# Altium schematic sheet 13_USB3_0_peripheral.SchDoc: USB3_0 Peripheral
size A3; Author: NeoExiZ; CompanyName: BUPT CPS Lab; Engineer: NeoExiZ; Organization: NeoExiZ; Address1: 418, 4#Building,BUPT; Address2: No.10, Xitucheng Road; Address3: Beijing; Address4: China
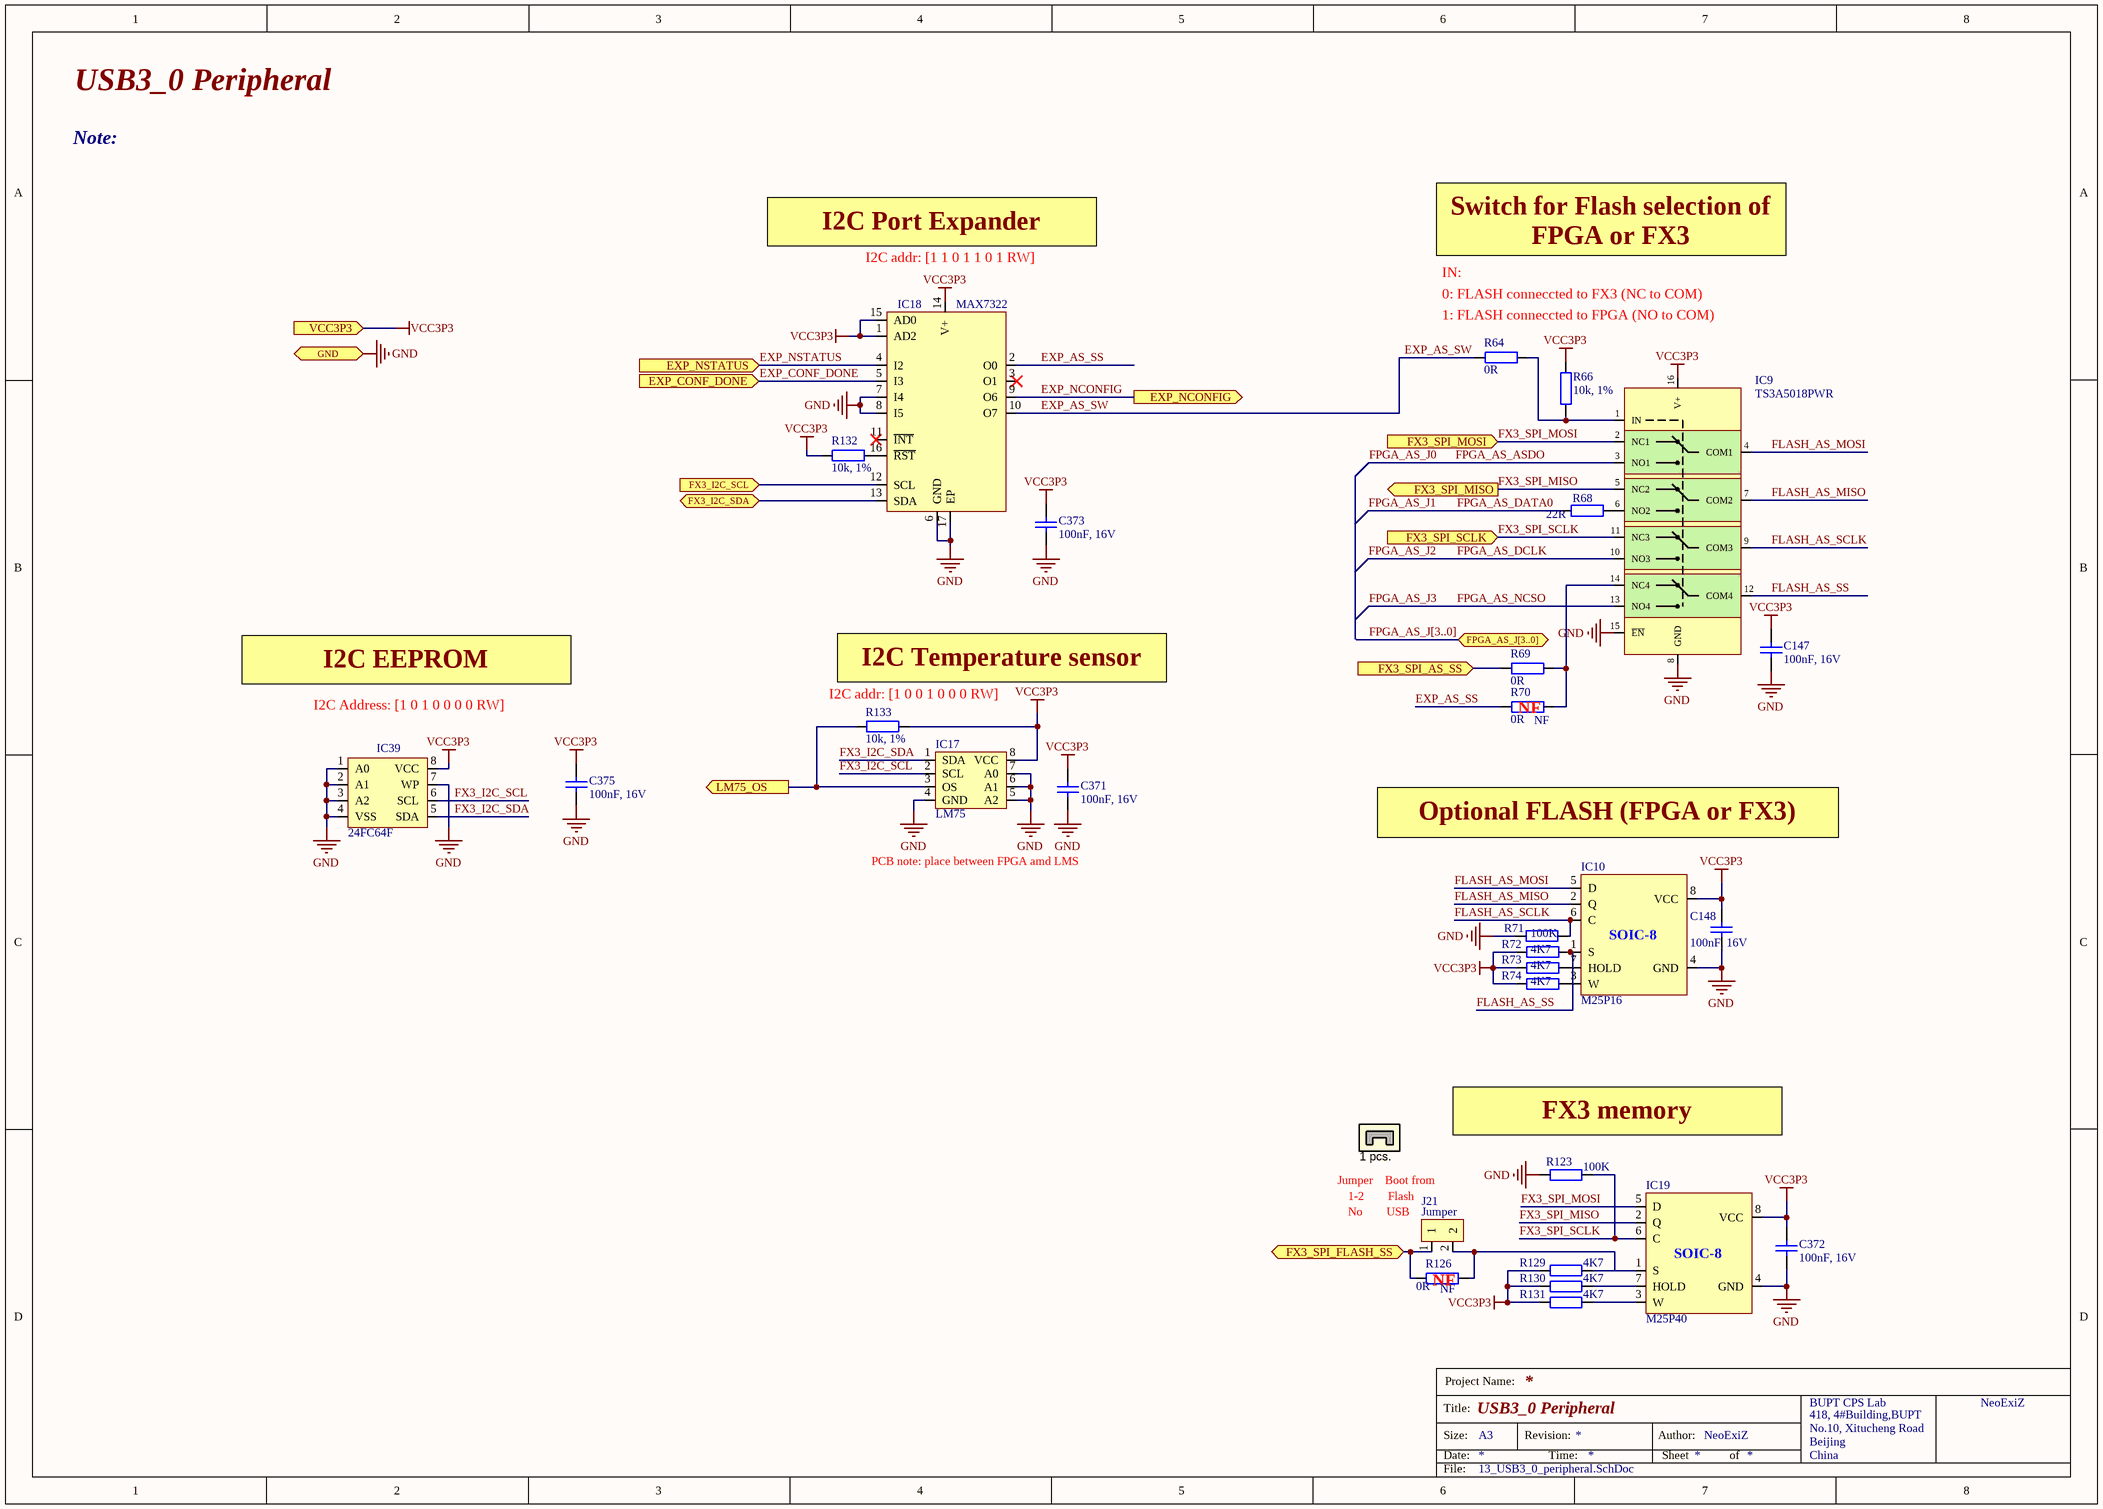
[diagram p0: 13_USB3_0_peripheral.SchDoc]

## Parts
C147  100nF, 16V  [CAP0402]
C148  100nF, 16V  [CAP0402]
C371  100nF, 16V  [CAP0402]
C372  100nF, 16V  [CAP0402]
C373  100nF, 16V  [CAP0402]
C375  100nF, 16V  [CAP0402]
IC9  TS3A5018PWR  [TS3A5018PWR]
IC10  M25P16  [M25P40-VMN6TPB_SO8N]
IC17  LM75  [HWSON8_LM75]
IC18  MAX7322  [MAX7322ATE_QFN16]
IC19  M25P40  [M25P40-VMN6TPB_SO8N]
IC39  24FC64F  [24FC512]
J21  Jumper  [HDR_1x2_HALF_PITCH]
JMP1  1 pcs.  [MECH_JUMPER_HALF_PITCH]
R64  0R  [RES0402]
R66  10k, 1%  [RES0402]
R68  22R  [RES0402]
R69  0R  [RES0402]
R70  0R  Assembly Info: NF  [RES0402]
R71  100K  [RES0402]
R72  4K7  [RES0402]
R73  4K7  [RES0402]
R74  4K7  [RES0402]
R123  100K  [RES0402]
R126  0R  Assembly Info: NF  [RES0402]
R129  4K7  [RES0402]
R130  4K7  [RES0402]
R131  4K7  [RES0402]
R132  10k, 1%  [RES0402]
R133  10k, 1%  [RES0402]

## Ports
EXP_CONF_DONE (in), EXP_NCONFIG (out), EXP_NSTATUS (in), FPGA_AS_J[3..0], FX3_I2C_SCL (in), FX3_I2C_SDA (bidir), FX3_SPI_AS_SS (in), FX3_SPI_FLASH_SS (bidir), FX3_SPI_MISO (out), FX3_SPI_MOSI (in), FX3_SPI_SCLK (in), GND, LM75_OS (out), VCC3P3 (in)

## Nets
GND: C147.2 C148.2 C371.2 C372.2 C373.2 C375.2 IC9.8(GND) IC9.15(~{EN}) IC10.4(GND) IC17.4(GND) IC17.5(A2) IC17.6(A1) IC17.7(A0) IC18.6(GND) IC18.7(I4) IC18.8(I5) IC18.17(EP) IC19.4(GND) IC39.1(A0) IC39.2(A1) IC39.3(A2) IC39.4(VSS) IC39.7(WP) R71.2 R123.1 ; port GND
VCC3P3: C147.1 C148.1 C371.1 C372.1 C373.1 C375.1 IC9.16(V+) IC10.8(VCC) IC17.8(VCC) IC18.1(AD2) IC18.14(V+) IC18.15(AD0) IC19.8(VCC) IC39.8(VCC) R66.1 R72.1 R73.1 R74.1 R129.1 R130.1 R131.1 R132.1 R133.2 ; port VCC3P3
EXP_AS_SS: IC18.2(O0) R70.2
EXP_AS_SW: IC18.10(O7) R64.2
EXP_CONF_DONE: IC18.5(I3) ; port EXP_CONF_DONE
EXP_NCONFIG: IC18.9(O6) ; port EXP_NCONFIG
EXP_NSTATUS: IC18.4(I2) ; port EXP_NSTATUS
FLASH_AS_MISO: IC9.7(COM2) IC10.2(Q)
FLASH_AS_MOSI: IC9.4(COM1) IC10.5(D)
FLASH_AS_SCLK: IC9.9(COM3) IC10.6(C) R71.1
FLASH_AS_SS: IC9.12(COM4) IC10.1(S) R72.2
FPGA_AS_ASDO: IC9.3(NO1)  [also labelled FPGA_AS_J0]
FPGA_AS_DATA0: R68.2  [also labelled FPGA_AS_J1]
FPGA_AS_DCLK: IC9.10(NO3)  [also labelled FPGA_AS_J2]
FPGA_AS_J3: IC9.13(NO4)  [also labelled FPGA_AS_NCSO]
FX3_I2C_SCL: IC17.2(SCL) IC39.6(SCL)
FX3_I2C_SCL: IC18.12(SCL) ; port FX3_I2C_SCL  [a separate net that carries the same name]
FX3_I2C_SDA: IC17.1(SDA) IC39.5(SDA)
FX3_I2C_SDA: IC18.13(SDA) ; port FX3_I2C_SDA  [a separate net that carries the same name]
FX3_SPI_AS_SS: R69.2 ; port FX3_SPI_AS_SS
FX3_SPI_FLASH_SS: J21.1 R126.1 ; port FX3_SPI_FLASH_SS
FX3_SPI_MISO: IC9.5(NC2) IC19.2(Q) ; port FX3_SPI_MISO
FX3_SPI_MOSI: IC9.2(NC1) IC19.5(D) ; port FX3_SPI_MOSI
FX3_SPI_SCLK: IC9.11(NC3) IC19.6(C) R123.2 ; port FX3_SPI_SCLK
LM75_OS: IC17.3(OS) R133.1 ; port LM75_OS
NetIC9_1: IC9.1(IN) R64.1 R66.2
NetIC9_6: IC9.6(NO2) R68.1
NetIC9_14: IC9.14(NC4) R69.1 R70.1
NetIC10_3: IC10.3(W) R74.2
NetIC10_7: IC10.7(HOLD) R73.2
NetIC18_16: IC18.16(~{RST}) R132.2
NetIC19_1: IC19.1(S) J21.2 R126.2 R129.2
NetIC19_3: IC19.3(W) R131.2
NetIC19_7: IC19.7(HOLD) R130.2

Not connected (* = marked no-connect by the designer): IC18 3(O1)* 11(~{INT})*; JMP1 1 2

## Buses and harness runs
bus FPGA_AS_J[3..0] = port FPGA_AS_J[3..0]

## Notes on the sheet
- I2C Port Expander
- (near IC18) I2C addr: [1 1 0 1 1 0 1 RW]
- Switch for Flash selection of FPGA or FX3
- 0: FLASH conneccted to FX3 (NC to COM)
- IN:
- 1: FLASH conneccted to FPGA (NO to COM)
- I2C EEPROM
- I2C Address: [1 0 1 0 0 0 0 RW]
- (near R133) I2C addr: [1 0 0 1 0 0 0 RW]
- (near R133) I2C Temperature sensor
- (near R70) NF
- Optional FLASH (FPGA or FX3)
- PCB note: place between FPGA amd LMS
- Jumper    Boot from
- FX3 memory
- (near J21) 1-2        Flash
- (near J21) No        USB
- (near R126) NF
- Note:
- Project Name:
- Size:
- Date:
- Title:
- A3
- Revision:
- Time:
- Author:
- Sheet
- of
- File:
- (in symbol M25P40) SOIC-8

## Library data of the parts
C147 C148 C371-C373 C375 = Cap_0603: Manufacturer Part Number 1: GRM155R71C104KA88D; Part Description: 0.10µF ±10% 16V X7R Ceramic Capacitor -55°C ~ 125°C Surface Mount, MLCC 0402 (1005 Metric) 0.039" L x 0.020" W (1.00mm x 0.50mm); Brand: Murata Electronics; Tolerance: 10 %; Type: General Purpose MLCC; Capacitance: 0.1 uF; Temperature Coefficient / Code: +/- 15 %; Supplier 1: Mouser; Supplier Part Number 1: 81-GRM155R71C104KA88; Case Code - in: 0402; Manufacturer: Murata Electronics; Category: Multilayer Ceramic Capacitors MLCC - SMD/SMT; Voltage Rating DC: 16 V; Value: 100nF, 16V; Manufacturer Part Number: GRM155R71C104KA88D
IC9 = TS3A5018PWR: Manufacturer: TEXAS INSTRUMENTS; Part Description: IC SWITCH QUAD SPDT 16TSSOP; On State Resistance Max: 10; Analog Switch Case: TSSOP; Supply Voltage Range: 2.3V to 3.6; No. of Pins: 16; Analog Switch Type: SPDT; Supplier 1: Newark; Manufacturer Part Number 1: TS3A5018PW; Supplier Part Number 1: 71J8329
IC10 = M25P40: Manufacturer Part Number 1: M25P16-VMN6P; Manufacturer: Micron Technology Inc.; Part Description: IC FLASH 16MBIT 75MHZ 8SO; Supply Voltage Min: 2.7; Supply Voltage Max: 3.6; Memory Case Style: NSOIC; Memory Type: Flash; Memory Size: 16; Flash Memory Configuration: 2M x 8; No. of Pins: 8; Clock Frequency: 75; IC Interface Type: Serial, SPI; Page / Burst Read Access: 0.8; Supply Voltage Range: 2.7V to 3.6; Supplier 1: Farnell; Supplier Part Number 1: 1734973; RoHS: YES; Access Time: -; Operating Temperature Min: -40; Operating Temperature Max: 85; Packaging: Each; MSL: MSL 3 - 168 hours; Memory Voltage Vcc: 3.6; Operating Temperature Range: -40°C to +85
IC17 = LM75: Manufacturer: NXP Semiconductors; Manufacturer Part Number: LM75BTP,147; Part Description: SENSOR TEMPERATURE I2C 8HWSON; Sensing Temperature - Local: -55°C ~ 125°C; Output Type: I²C; Accuracy - Highest (Lowest): ±2°C (±3°C); Voltage - Supply: 2.8 V ~ 5.5 V; Test Condition: -25°C ~ 100°C (-55°C ~ 125°C); Sensor Type: Digital, Local; Resolution: 10 b; Supplier 1: Digi-Key; Operating Temperature: -55°C ~ 125°C; Features: Output Switch, Programmable Limit, Shutdown Mode; Supplier Device Package: 8-HWSON (2x3); Sensing Temperature - Remote: -; Category: Sensors, Transducers; Packaging: Tape & Reel (TR); RoHS: RoHS Compliant; Package / Case: 8-WFDFN Exposed Pad; Supplier Part Number 1: 568-9815-2-ND
IC18 = MAX7322ATE+: Manufacturer: Maxim Integrated; Part Description: IC I/O EXPANDER I2C 4B 16TQFN; Interface: I²C; Number of I/O: 4 (Input Only); Voltage - Supply: 1.7 V ~ 5.5 V; Interrupt Output: Yes; Current - Output Source/Sink: 20mA; Frequency - Clock: 400kHz; Supplier 1: Digi-Key; Mounting Type: Surface Mount; Category: Integrated Circuits (ICs); RoHS: RoHS Compliant; Packaging: Tube; Manufacturer Part Number: MAX7322ATE+; Supplier Device Package: 16-TQFN-EP (3x3); Package / Case: 16-WFQFN Exposed Pad; Operating Temperature: -40°C ~ 125°C; Features: POR; Output Type: -; Supplier Part Number 1: MAX7322ATE+-ND
IC19 = M25P40: Manufacturer: Micron Technology Inc; Part Description: IC FLASH 4MBIT 75MHZ 8SO; Manufacturer Part Number 1: M25P40-VMN6TPB; Memory Size: 4M (512K x 8); Voltage - Supply: 2.3 V ~ 3.6 V; Supplier 1: Digi-Key; Supplier Device Package: 8-SO; Supplier Part Number 1: M25P40-VMN6TPBTR-ND
IC39 = 24FC64F: Manufacturer Part Number 1: 24FC64F-I/ST; Manufacturer: Microchip Technology; Part Description: IC EEPROM 512KBIT 1MHZ 8TSSOP; Format - Memory: EEPROMs - Serial; Speed: 400kHz, 1MHz; Interface: I²C, 2-Wire Serial; Memory Type: EEPROM; Memory Size: 64K (8K x 8); Voltage - Supply: 1.7 V ~ 5.5 V; Supplier 1: Digi-Key; Packaging: Tube; Supplier Device Package: 8-TSSOP; Operating Temperature: -40°C ~ 85°C; RoHS: RoHS Compliant; Category: Integrated Circuits (ICs); Package / Case: 8-TSSOP (0.173", 4.40mm Width); Supplier Part Number 1: 24FC64F-I/ST-ND
J21 = Jumper: Manufacturer Part Number 1: GRPB021VWVN-RC; Manufacturer: Sullins Connector Solutions; Part Description: 2 Positions Header, Unshrouded Connector 0.050" (1.27mm) Through Hole Gold; Connector Type: Header, Unshrouded; Number of Positions: 2; Number of Positions Loaded: All; Pitch: 0.050" (1.27mm); Supplier 1: Digi-Key; Supplier Part Number 1: S9014E-02-ND; Contact Mating Length: 0.118" (3.00mm); Mounting Type: Through Hole; Termination: Solder; Fastening Type: -; Features: -; Contact Finish: Gold; Contact Finish Thickness: Flash; Color: -; Category: Connectors, Interconnects; RoHS: RoHS Compliant; Packaging: Bulk; Contact Type: Male Pin; Number of Rows: 1; Row Spacing: -
JMP1 = JUMP_2P_CONN_HEADER: Shorting Jumper, 2-position, 1.27mm pitch; Manufacturer Part Number 1: M50-2030005; Manufacturer: Harwin Inc.; Part Description: CONN SHUNT 1.27MM BLUE W/HANDLE; Gender: Female Sockets; Number of Positions or Pins (Grid): 2 (1 x 2); Pitch: 0.050" (1.27mm); Supplier 1: Digi-Key; Supplier Part Number 1: 952-1732-ND; Category: Connectors, Interconnects; RoHS: RoHS Compliant; Packaging: Bulk; Type: Closed Top, Grip; Height: 0.217" (5.50mm); Contact Finish: Gold; Contact Finish Thickness: 1µin (0.025µm); Color: Blue
R64 R69 R70 = Res_0402: Manufacturer: Yageo; Part Description: RES SMD 0.0OHM JUMPER 1/16W 0402; Supplier 1: Digi-Key; Supplier Part Number 1: 311-0.0JRTR-ND; Composition: Thick Film; Package / Case: 0402 (1005 Metric); Category: Resistors; Value: 0R
R66 R132 R133 = Res_0402: Manufacturer: Yageo; Manufacturer Part Number 1: RC0402FR-0710KL; Part Description: RES SMD 10K OHM 1% 1/16W 0402; Temperature Coefficient: ±100ppm/°C; Power (Watts): 0.063W, 1/16W; Value: 10k, 1%; Supplier 1: Digi-Key; Supplier Part Number 1: 311-10.0KLRTR-ND; Resistance (Ohms): 10k; Packaging: Tape & Reel (TR); RoHS: RoHS Compliant; Package / Case: 0402 (1005 Metric); Tolerance: ±1%; Operating Temperature: -55°C ~ 155°C; Size / Dimension: 0.039" L x 0.020" W (1.00mm x 0.50mm); Number of Terminations: 2; Category: Resistors; Height: 0.016" (0.40mm); Supplier Device Package: 0402; Features: Moisture Resistant; Composition: Thick Film
R68 = Res_0402: Part Description: RES SMD 22 OHM 1% 1/16W 0402; Manufacturer Part Number 1: RC0402FR-0722RL; Manufacturer: Yageo; Tolerance: ±1%; Temperature Coefficient: ±100ppm/°C; Resistance (Ohms): 22; Supplier 1: Digi-Key; Supplier Part Number 1: 311-22.0LRTR-ND; Supplier Device Package: 0402; Composition: Thick Film; Category: Resistors; Value: 22R
R71 R123 = Res_0402: Manufacturer Part Number 1: ERJ-2GEJ104X; Manufacturer: Panasonic Electronic Components; Part Description: RES SMD 100K OHM 5% 1/10W 0402; Tolerance: ±5%; Temperature Coefficient: ±200ppm/°C; Power (Watts): 0.1W, 1/10W; Supplier 1: Digi-Key; Supplier Part Number 1: P100KJCT-ND; Resistance (Ohms): 100k; Composition: Thick Film; Features: Automotive AEC-Q200; Number of Terminations: 2; Height: 0.016" (0.40mm); RoHS: RoHS Compliant; Package / Case: 0402 (1005 Metric); Packaging: Cut Tape (CT); Size / Dimension: 0.039" L x 0.020" W (1.00mm x 0.50mm); Supplier Device Package: 0402; Operating Temperature: -55°C ~ 155°C; Category: Resistors
  R71: value: 100K
  R123: Value: 100K
R72-R74 R129-R131 = Res_0402: Manufacturer Part Number 1: RMCF0402JT4K70; Part Description: RES SMD 4.7K OHM 5% 1/16W 0402; Manufacturer: Stackpole Electronics Inc.; Temperature Coefficient: ±100ppm/°C; Resistance(Ohms): 4.7k; Tolerance: ±5%; Supplier 1: Digi-Key; Composition: Thick Film; Supplier Device Package: 0402; Supplier: Digi-Key; Supplier Part Number 1: RMCF0402JT4K70TR-ND; Category: Resistors; Value: 4K7
R126 = Res_0402: Manufacturer Part Number 1: RC0402JR-070RL; Manufacturer: Yageo; Part Description: RES SMD 0.0OHM JUMPER 1/16W 0402; Resistance (Ohms): 0.0; Tolerance: Jumper; Power (Watts): 0.063W, 1/16W; Value: 0R; Supplier 1: Digi-Key; Supplier Part Number 1: 311-0.0JRTR-ND; Category: Resistors; Temperature Coefficient: -; Features: Moisture Resistant; Supplier Device Package: 0402; Height: 0.016" (0.40mm); Package / Case: 0402 (1005 Metric); Operating Temperature: -55°C ~ 155°C; Size / Dimension: 0.039" L x 0.020" W (1.00mm x 0.50mm); Composition: Thick Film; Packaging: Tape & Reel (TR); Number of Terminations: 2; RoHS: RoHS Compliant